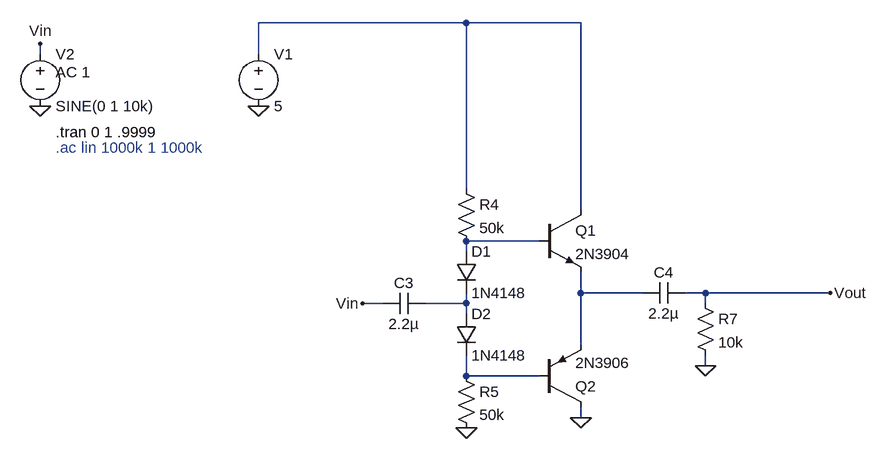
[diagram p0: schematic 04B-015.asc]
04B-015.asc, the LTspice schematic file:
Version 4.1
SHEET 1 880 680
WIRE 48 -144 -272 -144
WIRE 224 -144 48 -144
WIRE -608 -96 -608 -112
WIRE -272 -96 -272 -144
WIRE 48 112 48 -144
WIRE 224 144 224 -144
WIRE 160 192 48 192
WIRE 48 208 48 192
WIRE 224 272 224 240
WIRE 320 272 224 272
WIRE 416 272 384 272
WIRE 608 272 416 272
WIRE -80 288 -112 288
WIRE 48 288 48 272
WIRE 48 288 -16 288
WIRE 416 288 416 272
WIRE 48 304 48 288
WIRE 224 352 224 272
WIRE 416 384 416 368
WIRE 48 400 48 368
WIRE 160 400 48 400
WIRE 224 464 224 448
FLAG 48 480 0
FLAG -272 -16 0
FLAG -608 -16 0
FLAG -608 -112 Vin
FLAG 608 272 Vout
FLAG 416 384 0
FLAG -112 288 Vin
FLAG 224 464 0
SYMBOL npn 160 144 R0
SYMATTR InstName Q1
SYMATTR Value 2N3904
SYMBOL res 32 96 R0
SYMATTR InstName R4
SYMATTR Value 50k
SYMBOL res 32 384 R0
SYMATTR InstName R5
SYMATTR Value 50k
SYMBOL voltage -272 -112 R0
WINDOW 123 0 0 Left 0
WINDOW 39 0 0 Left 0
SYMATTR InstName V1
SYMATTR Value 5
SYMBOL voltage -608 -112 R0
WINDOW 123 24 44 Left 2
WINDOW 39 0 0 Left 0
SYMATTR Value2 AC 1
SYMATTR InstName V2
SYMATTR Value SINE(0 1 10k)
SYMBOL cap -16 272 R90
WINDOW 0 0 32 VBottom 2
WINDOW 3 32 32 VTop 2
SYMATTR InstName C3
SYMATTR Value 2.2µ
SYMBOL cap 384 256 R90
WINDOW 0 0 32 VBottom 2
WINDOW 3 32 32 VTop 2
SYMATTR InstName C4
SYMATTR Value 2.2µ
SYMBOL res 400 272 R0
SYMATTR InstName R7
SYMATTR Value 10k
SYMBOL pnp 160 448 M180
SYMATTR InstName Q2
SYMATTR Value 2N3906
SYMBOL diode 32 208 R0
SYMATTR InstName D1
SYMATTR Value 1N4148
SYMBOL diode 32 304 R0
SYMATTR InstName D2
SYMATTR Value 1N4148
TEXT -584 24 Left 2 !.tran 0 1 .9999
TEXT -584 48 Left 2 ;.ac lin 1000k 1 1000k

The netlist it stands for:
* 04B-015.asc
Q1 N001 N002 N003 0 2N3904
R4 N001 N002 50k
R5 N005 0 50k
V1 N001 0 5
V2 Vin 0 SINE(0 1 10k) AC 1
C3 N004 Vin 2.2µ
C4 Vout N003 2.2µ
R7 Vout 0 10k
Q2 0 N005 N003 0 2N3906
D1 N002 N004 1N4148
D2 N004 N005 1N4148
.model D D
.lib standard.dio
.model NPN NPN
.model PNP PNP
.lib standard.bjt
.tran 0 1 .9999
* .ac lin 1000k 1 1000k
.backanno
.end